# EAGLE design nodeBoard (EAGLE 9.6.2)
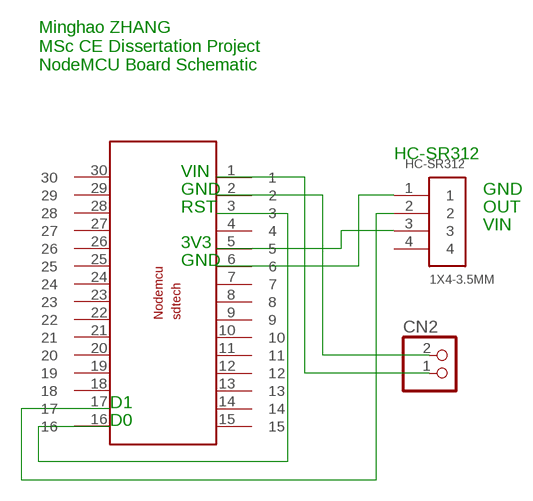
[diagram p0: schematic, sheet 1]

## Parts
CN2  JST_2PIN-SMT  [JST-PH-2-SMT]
HC-SR312  1X4-3.5MM  [1X04-3.5MM]
U$1  NODEMCUESP8266  [NODEMCUESP8266]

## Nets
N$1: CN2.1 U$1.1
N$2: CN2.2 U$1.2
N$3: HC-SR312.2 U$1.17
N$4: HC-SR312.3 U$1.5
N$5: HC-SR312.1 U$1.6
N$6: U$1.3 U$1.16
Unconnected: HC-SR312.4 U$1.4 U$1.7 U$1.8 U$1.9 U$1.10 U$1.11 U$1.12 U$1.13 U$1.14 U$1.15 U$1.18 U$1.19 U$1.20 U$1.21 U$1.22 U$1.23 U$1.24 U$1.25 U$1.26 U$1.27 U$1.28 U$1.29 U$1.30

## Notes on the sheet
- Minghao ZHANG
  MSc CE Dissertation Project
  NodeMCU Board Schematic
- HC-SR312
- VIN
- GND | GND
- RST | OUT
- VIN
- 3V3
- GND
- D1
- D0

## Library data of the parts
CN2 = adafruit:JST_2PIN: JST 2-Pin Connectors of various flavors SMT-RA (S2B-PH-SM4) 4UConnector #17311 SMT (B2B-PH-SM4) THM-RA (S2B-PH) THM (B2B-PH)
HC-SR312 = adafruit:1X4: 4-pin connector
U$1 = NODEMCU:NODEMCUESP8266: Node Mcu esp8266 12E LIBRARY BY SDTECH ROBOTICS (Shubham Devkar Technology Solutions)

## Board
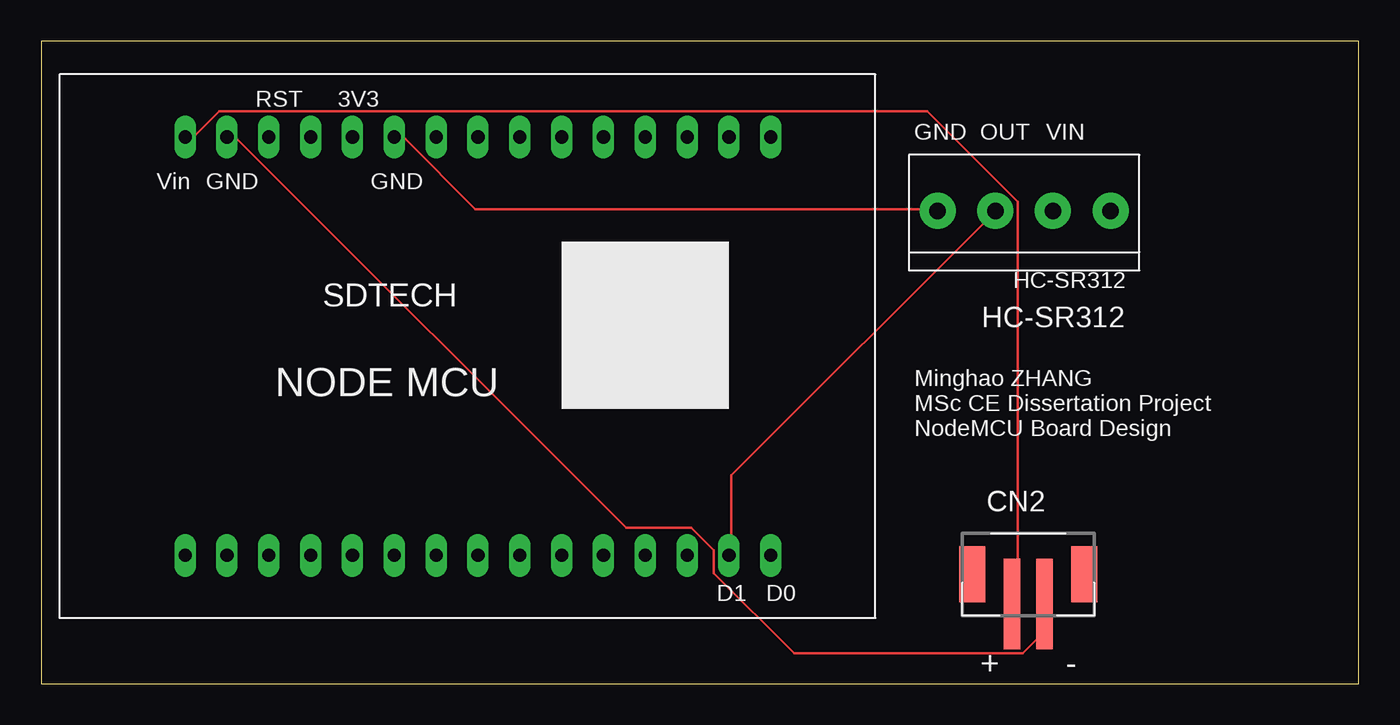
[diagram p1: board, top side]
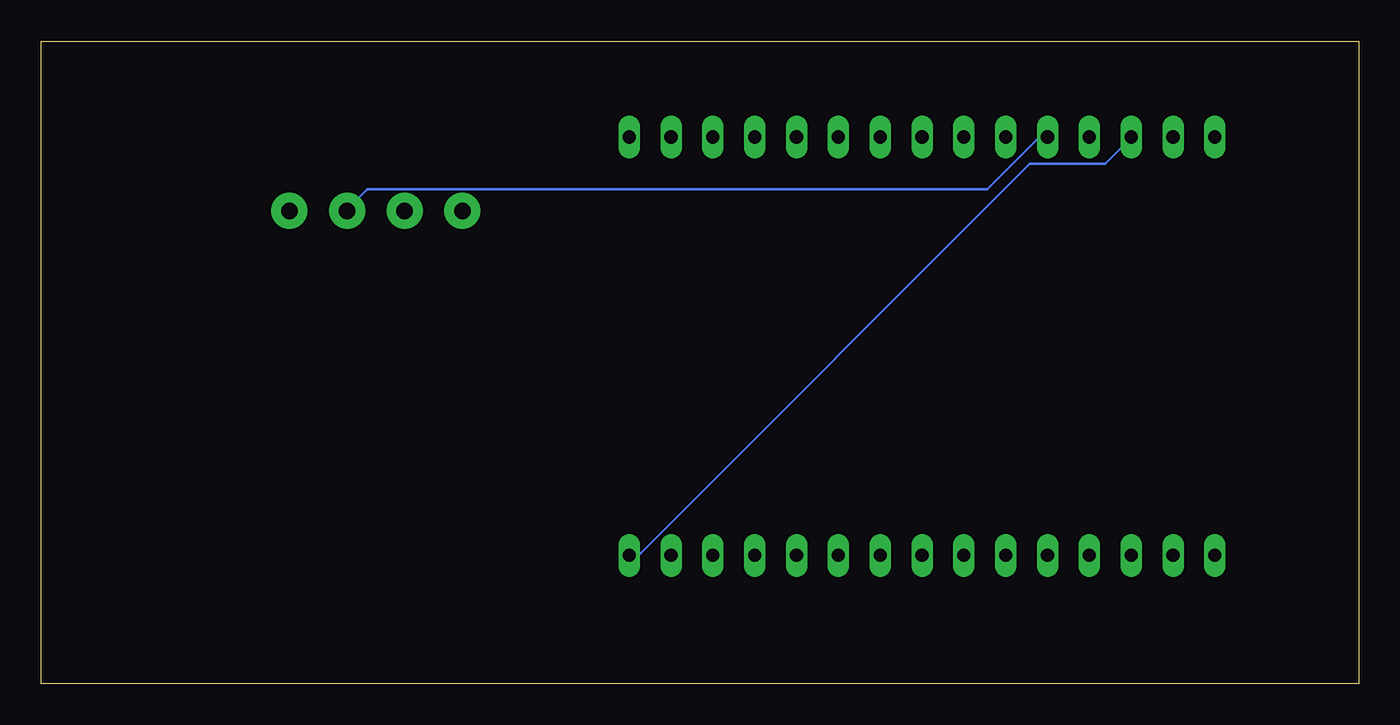
[diagram p2: board, bottom side, seen from below]

Size 80 x 39 mm. Coordinates in mm from the lower left corner, seen from the top.
Outline: 0,0 80,0 80,39 0,39 0,0
Copper layers (1*16): Top 0.035mm / dielectric 1.5mm / Bottom 0.035mm
Design rules "default": minimum track width 6mil, minimum drill 0.35mm, track to track 6mil, track to pad 6mil, pad to pad 6mil, via to via 6mil, smd to smd 6mil, copper to edge 40mil, drill to drill 6mil, minimum pad ring 10mil, minimum via ring 8mil, stop-mask expansion 4mil, vias tented up to drill 0mil, thermal gap 10mil

### Footprints (pad centres in the part's own frame; a part is rotated, then mirrored left to right if it is on the bottom)
JST-PH-2-SMT = smd 1 x 5.5: 1 -1,-1.8; 2 1,-1.8 | smd 1.6 x 3.4: NC1 -3.4,0; NC2 3.4,0
1X04-3.5MM = drill 1 pad 2.184: 1 -5.25,0; 2 -1.75,0; 3 1.75,0; 4 5.25,0
NODEMCUESP8266 = drill 0.8 long: 1 15.24,15.24; 2 15.24,12.7; 3 15.24,10.16; 4 15.24,7.62; 5 15.24,5.08; 6 15.24,2.54; 7 15.24,0; 8 15.24,-2.54; 9 15.24,-5.08; 10 15.24,-7.62; 11 15.24,-10.16; 12 15.24,-12.7; 13 15.24,-15.24; 14 15.24,-17.78; 15 15.24,-20.32; 16 -10.16,-20.32; 17 -10.16,-17.78; 18 -10.16,-15.24; 19 -10.16,-12.7; 20 -10.16,-10.16; 21 -10.16,-7.62; 22 -10.16,-5.08; 23 -10.16,-2.54; 24 -10.16,0; 25 -10.16,2.54; 26 -10.16,5.08; 27 -10.16,7.62; 28 -10.16,10.16; 29 -10.16,12.7; 30 -10.16,15.24

### Placement (x,y rotation side)
CN2  59.93,6.62 0 top
HC-SR312  59.68,28.69 0 top
U$1  23.98,17.94 90 top

### Tracks (layer width: path | path; a pad name or v marks a point on that pad's centre or on a via)
N$1
  Top 0.152: U$1.1 8.84,33.22 9.3,33.22 10.82,34.75 53.8,34.75 59.28,29.26 59.28,5.18 58.98,4.88 CN2.1
N$2
  Top 0.152: U$1.2 11.43,33.07 11.89,33.07 35.51,9.45 39.47,9.45 40.84,8.08 40.84,6.71 45.72,1.83 59.59,1.83 60.81,3.05 60.81,4.72 CN2.2
N$3
  Top 0.152: U$1.17 41.91,7.92 41.91,12.65 57.91,28.65 HC-SR312.2
N$4
  Bottom 0.152: U$1.5 19.05,33.07 19.51,33.07 22.55,30.02 60.2,30.02 61.42,28.8 HC-SR312.3
N$5
  Top 0.152: U$1.6 21.49,33.07 22.1,33.07 26.36,28.8 54.41,28.8 HC-SR312.1
N$6
  Bottom 0.152: U$1.16 44.2,7.92 43.59,7.92 19.96,31.55 15.39,31.55 13.87,33.07 U$1.3

### Text on the board
tPlace: RST | 3V3 | GND | OUT | VIN | Vin | GND | GND | HC-SR312 | Minghao ZHANG / MSc CE Dissertation Project / NodeMCU Board Design | D1 | D0